# EAGLE design PiTlnfo-V1.2-smd (EAGLE 7.3.0)
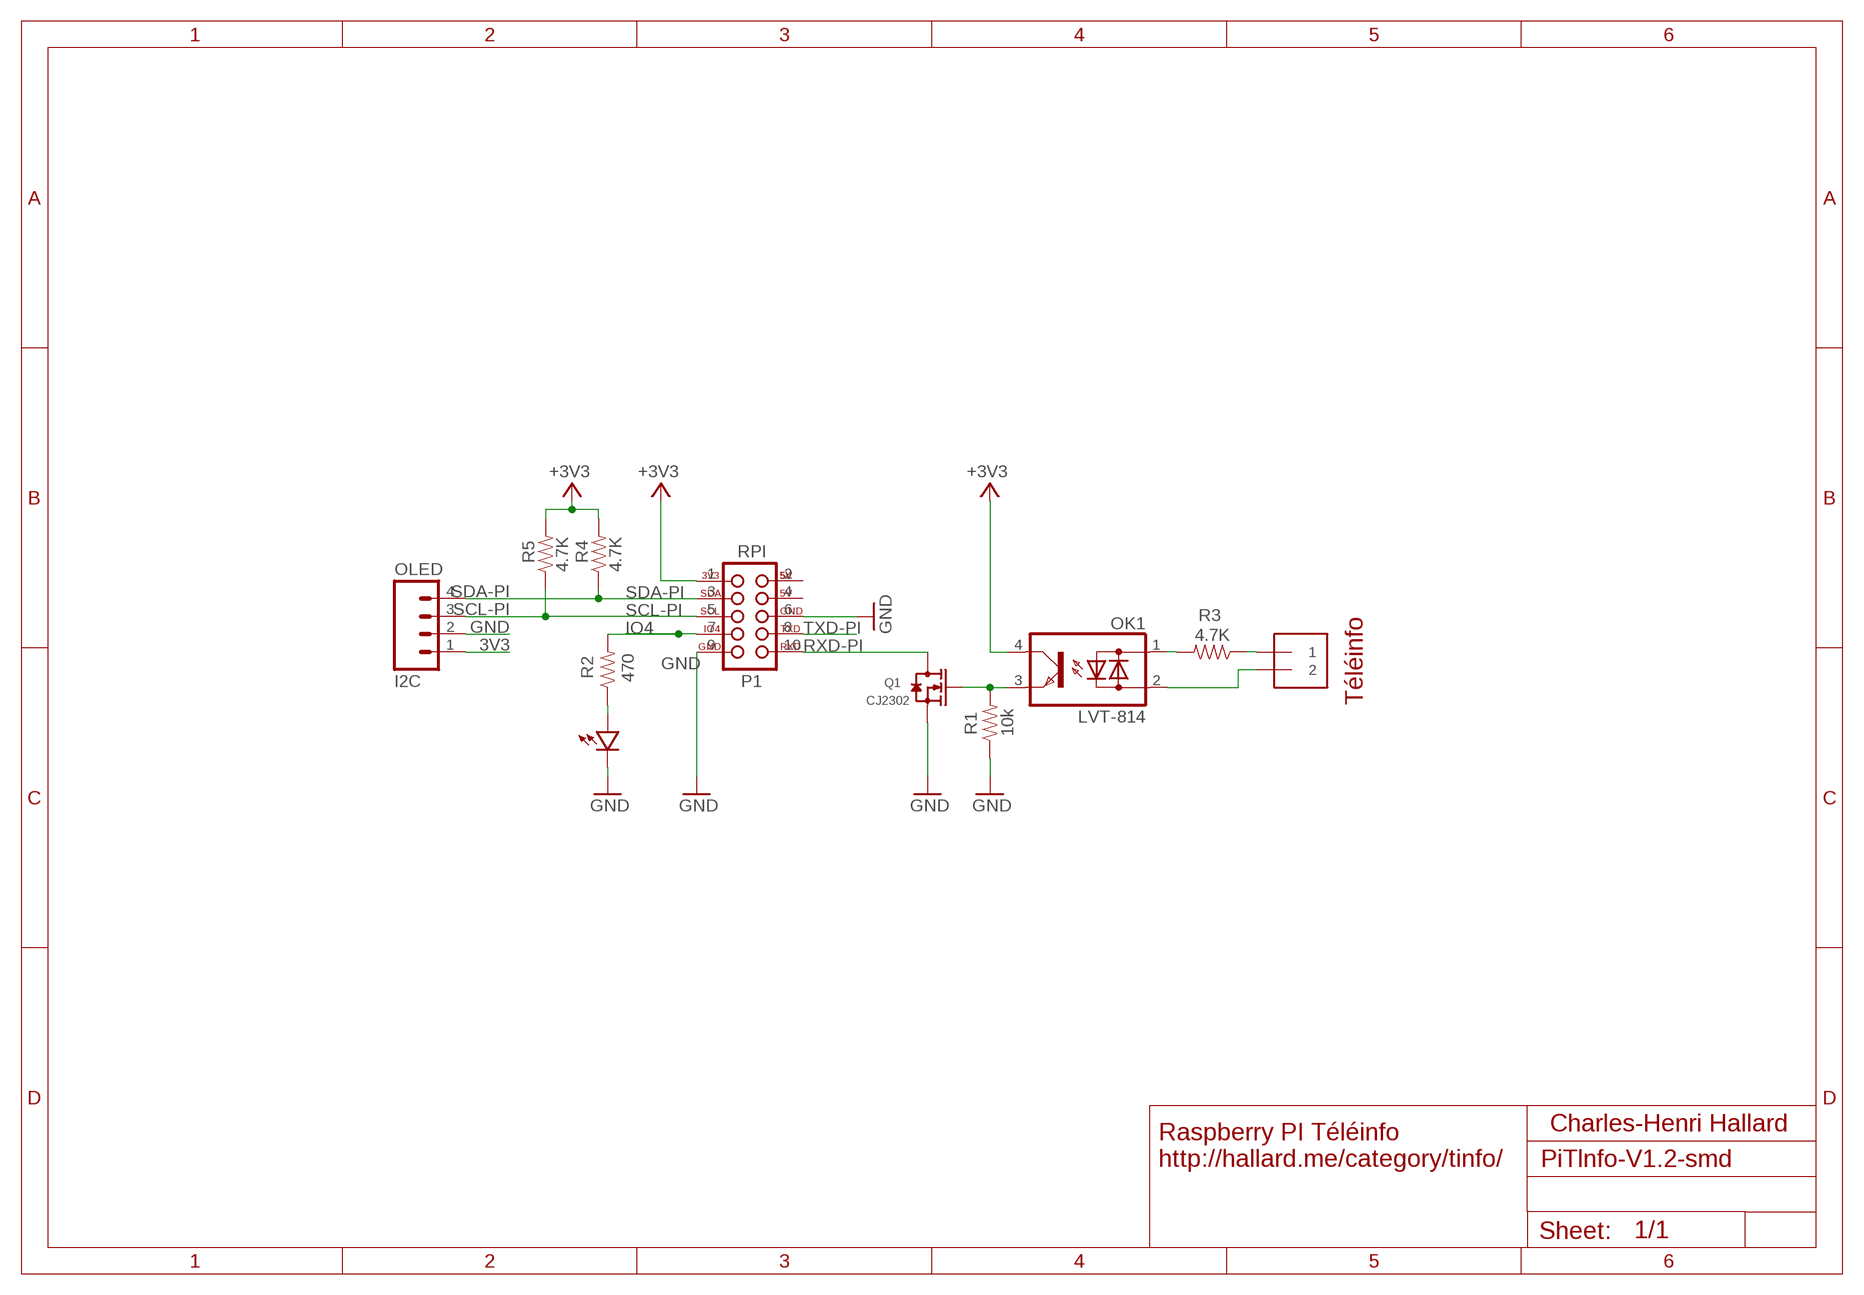
[diagram p0: schematic, sheet 1]

## Parts
J1  1X2-3.5MM  [1X2-3.5MM]
LED  LED0805  [0805-LED]
OK1  LVT-814  SFH620A  [DIL04]
OLED  I2C  M04LOCK  [1X04_LOCK]
Q1  CJ2302  MOSFET-N-''  [SOT23]
R1  10k  RESISTOR0805-RES  [0805-RES]
R2  470  RESISTOR0805-RES  [0805-RES]
R3  4.7K  RESISTOR0805-RES  [0805-RES]
R4  4.7K  RESISTOR0805-RES  [0805-RES]
R5  4.7K  RESISTOR0805-RES  [0805-RES]
U$2  RASPBERRY_PI_2X5  [2X05_LOCK]

## Nets
3V3 [power]: OK1.4(C) OLED.1 R4.2 R5.2 U$2.1 ; supply symbol labelled +3V3
GND [power]: LED.MINUS OLED.2 Q1.2(S) R1.1 U$2.6 U$2.9
IO4: R2.2 U$2.7
N$1: OK1.3(E) Q1.1(G) R1.2
N$2: LED.PLUS R2.1
N$5: J1.2 OK1.2(AC2)
N$6: J1.1 R3.1
N$7: OK1.1(AC1) R3.2
RXD-PI: Q1.3(D) U$2.10
SCL-PI: OLED.3 R5.1 U$2.5
SDA-PI: OLED.4 R4.1 U$2.3
TXD-PI: U$2.8

## Notes on the sheet
- Téléinfo
- Charles-Henri Hallard
- Raspberry PI Téléinfo
  http://hallard.me/category/tinfo/

## Power pins joined to a net without a drawn wire
2: U$2.2
4: U$2.4

## Library data of the parts
J1 = adafruit:1X2: 3.5mm Terminal block http://www.ladyada.net/library/pcb/eaglelibrary.html
LED = _c2h:LED
OK1 = optocoupler:SFH620: Optocoupler, Phototransistor Output, AC Input Source: http://www.vishay.com/docs/83675/sfh620.pdf; MPN: SFH620A-2; OC_FARNELL: 1469594; OC_NEWARK: 97K9546
OLED = SparkFun-Connectors:M04: Header 4 Standard 4-pin 0.1" header. Use with straight break away headers (SKU : PRT-00116), right angle break away headers (PRT-00553), swiss pins (PRT-00743), machine pins (PRT-00117), and female headers (PRT-00115). Molex polarized connector foot print use with SKU : PRT-08231 with associated crimp pins and housings. 1MM SMD Version SKU: PRT-10208
Q1 = Seeed-Discrete:MOSFET-N: CJ2302：SMD MOSFET N-CH 20V-2.1A
R1-R5 = _c2h:RESISTOR: Resistor Basic schematic elements and footprints for 0603, 1206, and PTH resistors.
U$2 = _c2h:RASPBERRY_PI_2X5

## Net classes
0 default: width 0.152 mm, drill 0.356 mm, clearance 0.152 mm
1 power: width 0.203 mm, drill 0.356 mm, clearance 0.152 mm

## Board
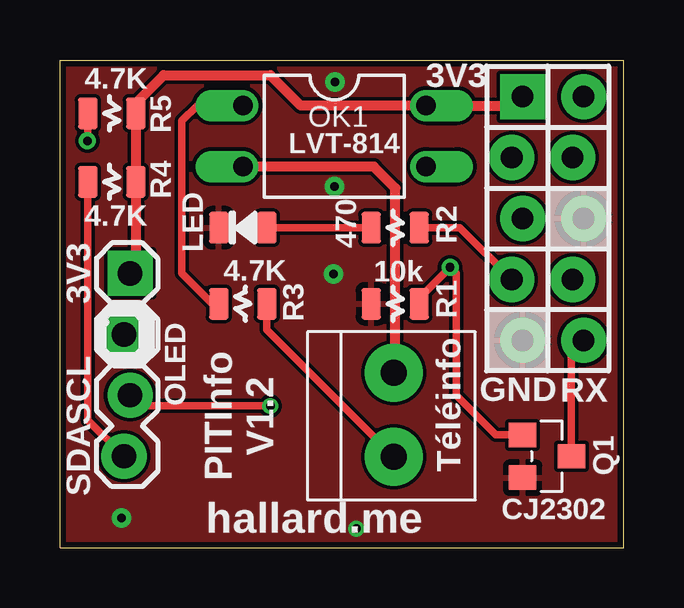
[diagram p1: board, top side]
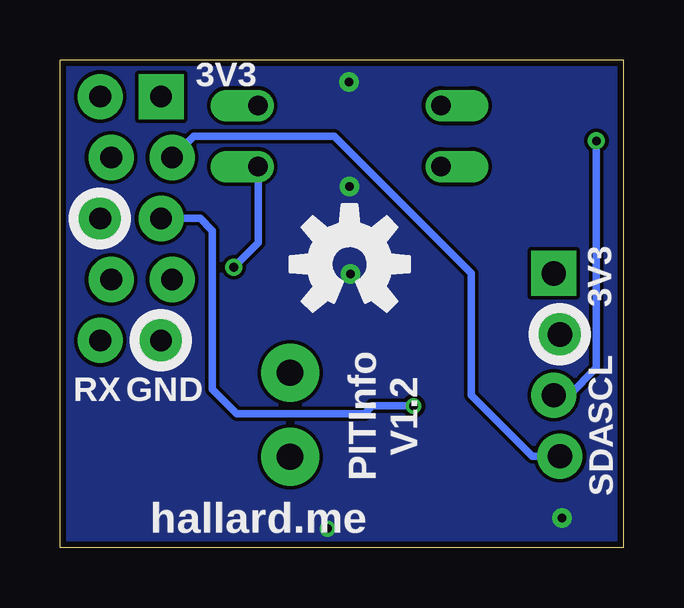
[diagram p2: board, bottom side, seen from below]

Size 23.5 x 20.32 mm. Coordinates in mm from the lower left corner, seen from the top.
Outline: 0,0 0,20.32 23.5,20.32 23.5,0 0,0
Copper layers (1*16): Top 0.035mm / dielectric 1.5mm / Bottom 0.035mm
Design rules "SeeedStudio_2layer_DRU_no_angle_20140221": minimum track width 6mil, minimum drill 12mil, track to track 6mil, track to pad 6mil, pad to pad 6mil, via to via 6mil, smd to smd 0mil, copper to edge 10mil, drill to drill 10mil, minimum pad ring 10mil, minimum via ring 6mil, stop-mask expansion 2mil, vias tented up to drill 100mil, thermal gap 10mil

### Footprints (pad centres in the part's own frame; a part is rotated, then mirrored left to right if it is on the bottom)
1X2-3.5MM = drill 1.1 pad 2.413: 1 1.8,0; 2 -1.7,0
0805-LED = smd 0.8 x 1.3: MINUS -1,0; PLUS 1,0
DIL04 = drill 0.813 offset: 1 -1.27,-3.81; 2 1.27,-3.81; 3 1.27,3.81; 4 -1.27,3.81
1X04_LOCK = drill 1.016 pad 1.88 square: 1 0,0.127 | drill 1.016 pad 1.88: 2 2.54,-0.127; 3 5.08,0.127; 4 7.62,-0.127
SOT23 = smd 1.016 x 1.143: 1 -0.889,-1.016; 2 0.889,-1.016; 3 0,1.016
0805-RES = smd 0.8 x 1.3: 1 -1,0; 2 1,0
2X05_LOCK = drill 0.9 pad 1.88 square: 1 -5.08,-1.041 | drill 0.9 pad 1.88: 2 -5.08,1.499; 3 -2.54,-1.499; 4 -2.54,1.041; 5 0,-1.041; 6 0,1.499; 7 2.54,-1.499; 8 2.54,1.041; 9 5.08,-1.041; 10 5.08,1.499

### Placement (x,y rotation side)
J1  13.91,5.59 270 top
LED  7.62,13.34 0 top
OK1  11.43,17.14 270 top
OLED  2.79,11.43 270 top
Q1  20.29,3.81 270 top
R1  13.97,10.16 0 top
R2  13.97,13.34 0 top
R3  7.62,10.16 180 top
R4  2.16,15.24 0 top
R5  2.16,18.1 0 top
U$1  [OSHW-LOGO-M]  11.43,11.81 0 bottom
U$2  20.32,13.72 270 top

### Tracks (layer width: path | path; a pad name or v marks a point on that pad's centre or on a via)
3V3
  Top 0.406: OLED.1 3.16,11.67 R4.2 R5.2 3.16,18.53 4.32,19.68 8.76,19.68 10.03,18.41 OK1.4 18.9,18.41 U$2.1
GND  (via drill 0.36 pad 0.61, 0.36 pad 0.81)
  other vias: 11.43,15.05 2.57,1.24 12.35,0.79 11.46,19.4 11.4,11.4
  pour Bottom: 0.25,20.26 23.37,20.19 23.37,0.25 0.25,0.25
  pour Top: 0.25,0.25 23.37,0.25 23.37,20.19 0.25,20.26
IO4
  Top 0.305: 18.57,11.43 U$2.7 16.66,13.34 R2.2
N$1  (via drill 0.36 pad 0.71)
  Top 0.305: R1.2 14.97,10.43 15,10.43 v16.26,11.68 16.51,11.43 16.51,6.35 18.16,4.7 Q1.1
  Bottom 0.305: OK1.3 15.24,12.7 v16.26,11.68
N$2
  Top 0.305: R2.1 LED.PLUS
N$5
  Top 0.406: OK1.2 13.08,15.88 13.97,14.99 13.97,7.3 J1.2
N$6
  Top 0.305: 8.62,10.28 R3.1 8.62,9.07 J1.1
N$7
  Top 0.305: OK1.1 5.71,18.41 5.08,17.78 5.08,11.43 6.35,10.16 R3.2
RXD-PI
  Top 0.305: Q1.3 21.3,8.12 U$2.10
SCL-PI  (via drill 0.36 pad 0.61, 0.36 pad 0.71)
  Top 0.305: v8.76,5.91 3.43,5.91 OLED.3 | R5.1 1.16,17.54 v1.14,16.95
  Bottom 0.305: 19.28,13.69 U$2.5 17.65,13.72 17.14,13.21 17.14,6.6 16.13,5.59 10.79,5.59 10.48,5.91 v8.76,5.91 | v1.14,16.95 1.14,7.49 2.29,6.35 OLED.3
SDA-PI
  Top 0.305: R4.1 1.16,5.32 OLED.4
  Bottom 0.305: U$2.3 17.93,17.14 12.06,17.14 6.35,11.43 6.35,6.35 3.81,3.81 OLED.4

### Text on the board
tNames: 3V3 | 3V3 | Téléinfo | SCL | OLED | GND | RX | PITInfo / V1.2 | SDA | hallard.me
bNames: 3V3 | 3V3 | GND | RX | SCL | PITInfo / V1.2 | SDA | hallard.me